# Altium project IOBoard2020.PrjPcb (part 3 of 3)

## Sheet PushButtons.SchDoc
size A3
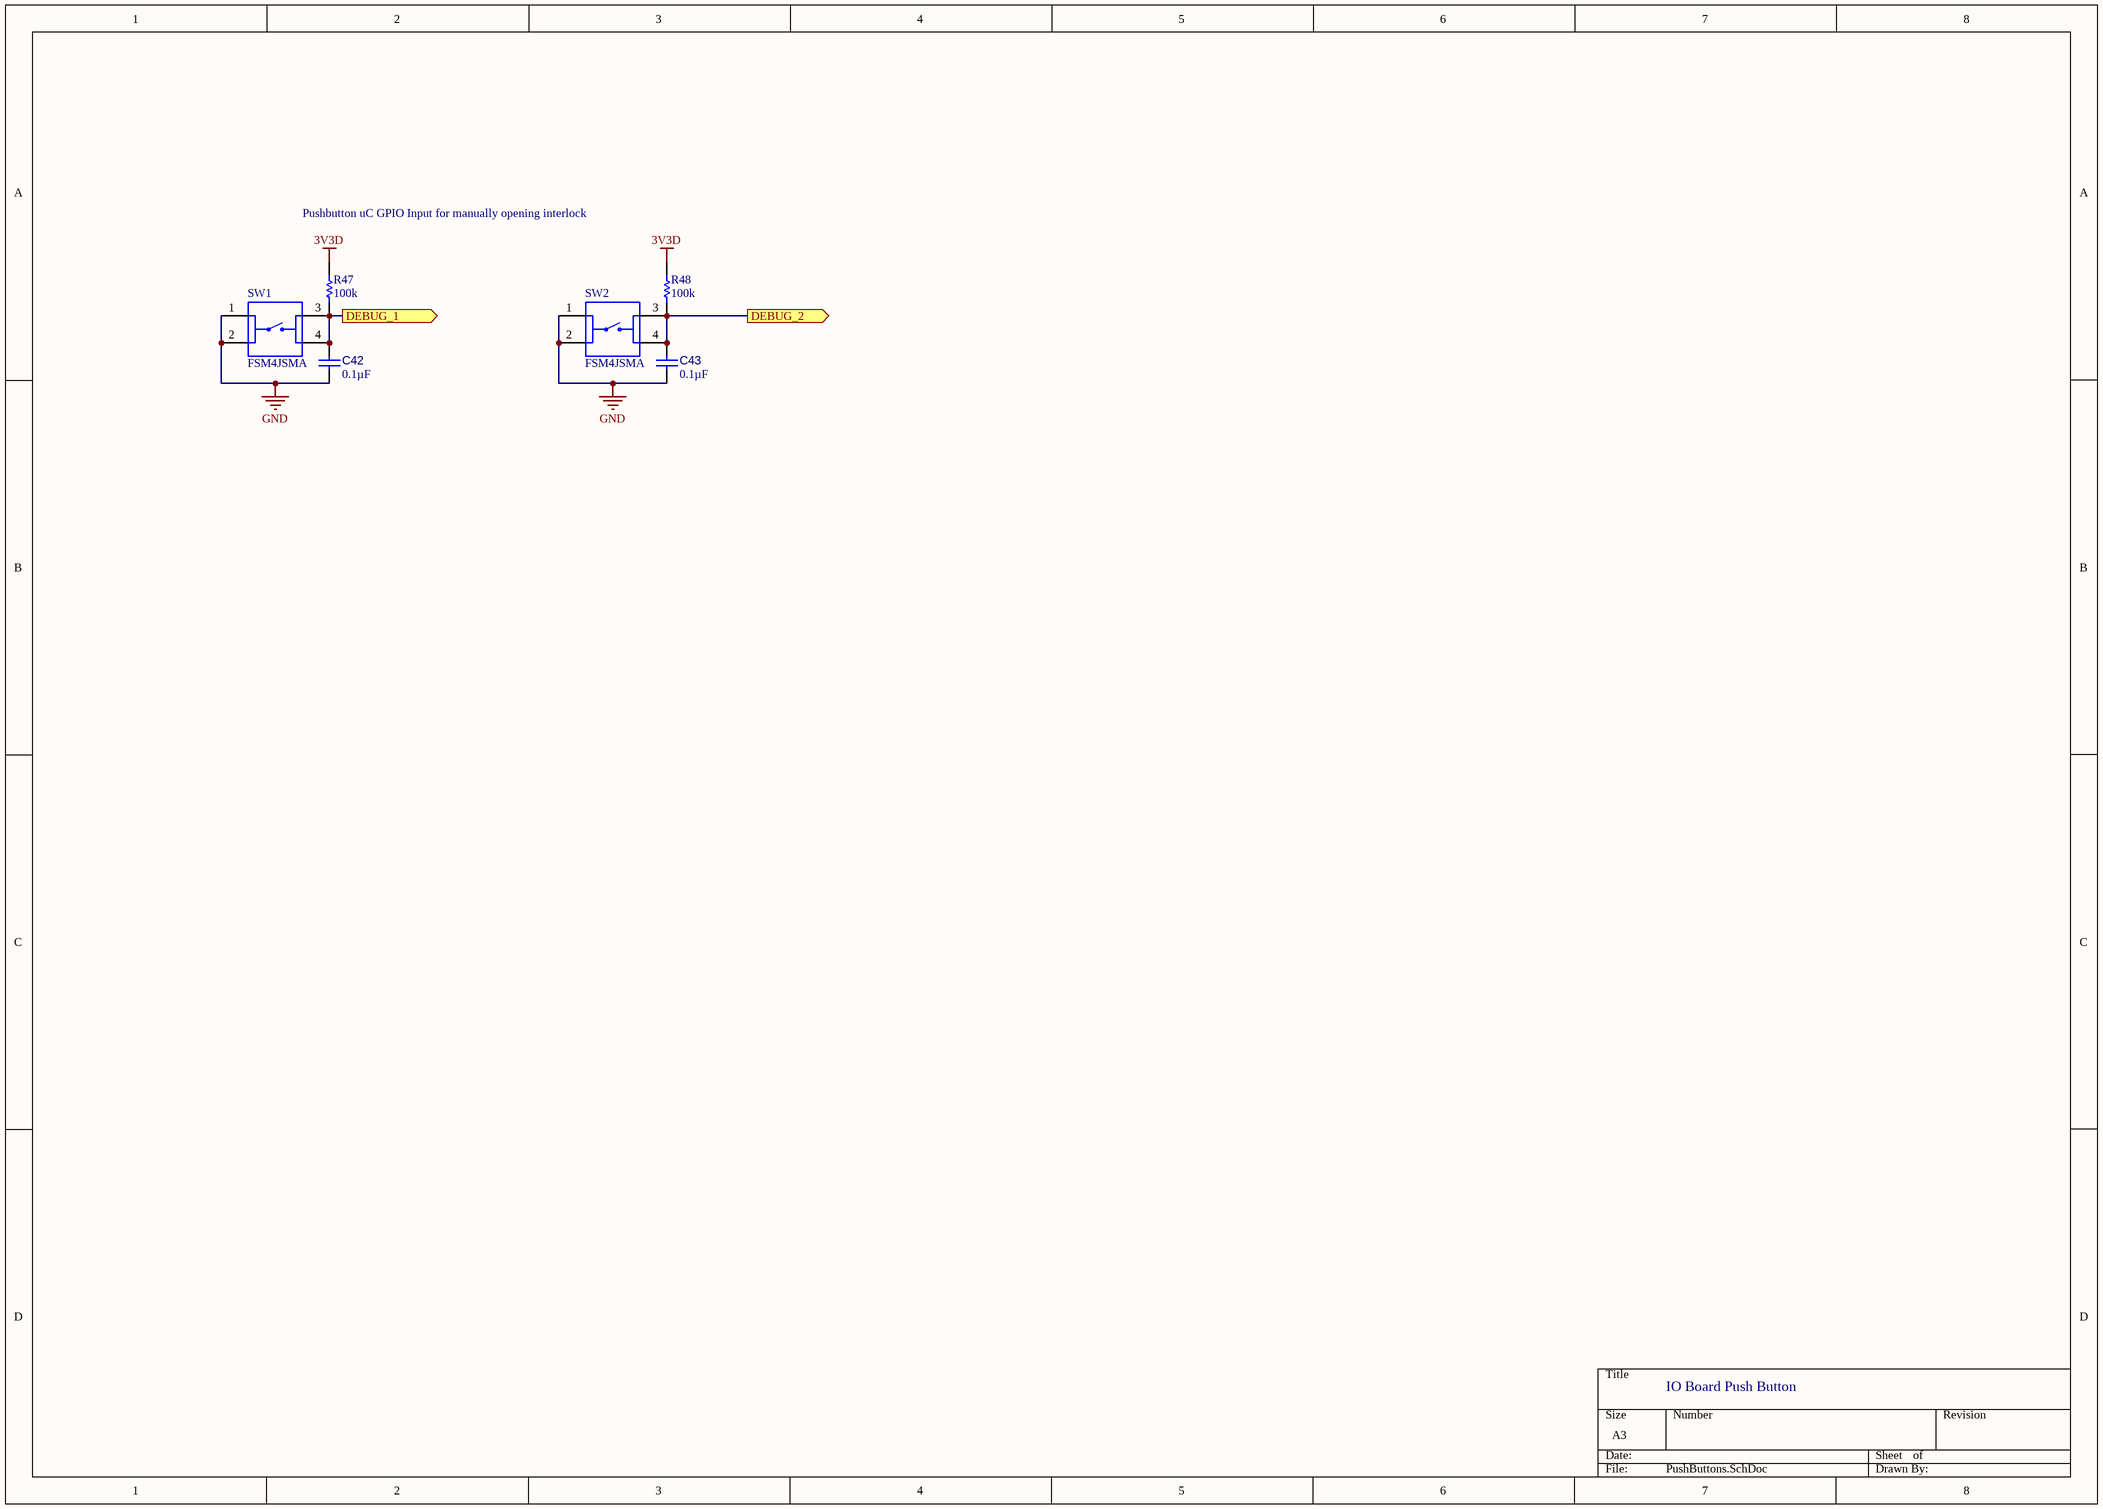
[diagram p6: PushButtons.SchDoc]

### Parts
C42  0.1µF  [CAPC2013X145X50ML20T25]
C43  0.1µF  [CAPC2013X145X50ML20T25]
R47  100k  [RESC2013X50X35ML15T15]
R48  100k  [RESC2013X50X35ML15T15]
SW1  FSM4JSMA  [TE_FSM4JSMA]
SW2  FSM4JSMA  [TE_FSM4JSMA]

### Ports
DEBUG_1 (out), DEBUG_2 (out)

### Nets
3V3D: R47.2 R48.2
GND: C42.1 C43.1 SW1.1 SW1.2 SW2.1 SW2.2
NetC42_2: C42.2 R47.1 SW1.3 SW1.4 ; port DEBUG_1
NetC43_2: C43.2 R48.1 SW2.3 SW2.4 ; port DEBUG_2

### Notes on the sheet
- Pushbutton uC GPIO Input for manually opening interlock
- IO Board Push Button

### Library data of the parts
C42 C43 = CMP-001-00010-4: Chip Capacitor, 0.1 uF, +/-10%, 25 V, 0805 (2012 Metric); Manufacturer: KEMET; Manufacturer Part Number: C0805C104K3RACTU; Dielectric Material: Ceramic; Tolerance: 10%; Capacitance: 100nF; Dielectric: X7R; Voltage: 25V; Value: 0.1µF; Supplier 1: Digi-Key; Supplier Part Number 1: 399-1168-1-ND; RoHS: Yes; Category: Ceramic Capacitors; Stock 1: 417116; Pricing 1: 1=0.14000, 10=0.10000, 50=0.05660, 100=0.04680, 500=0.03284, 1000=0.02719 (USD); Mount: Surface Mount; Case/Package: 0805; Min Operating Temperature: -55°C; Max Operating Temperature: 125°C; Packaging: Tape and Reel; Termination: SMD/SMT; Length: 2mm; Height: 0.9mm; Depth: 1.25mm; Radiation Hardening: No; ComponentLink1URL: https://datasheet.ciiva.com/18193/getdatasheetpartid-385649-18193413.pdf?src-supplier=Verical; ComponentLink1Description: https://datasheet.ciiva.com/18193/getdatasheetpartid-385649-18193413.pdf?src-supplier=Verical; ComponentLink2URL: https://datasheet.ciiva.com/7842/kem-c1002-x7r-smd-7842536.pdf?src-supplier=Element14; ComponentLink2Description: https://datasheet.ciiva.com/7842/kem-c1002-x7r-smd-7842536.pdf?src-supplier=Element14; ComponentLink3URL: https://datasheet.ciiva.com/7842/kem-c1002-x7r-smd-7842538.pdf?src-supplier=Element14; ComponentLink3Description: https://datasheet.ciiva.com/7842/kem-c1002-x7r-smd-7842538.pdf?src-supplier=Element14
R47 R48 = CMP-009-00001-4: Chip Resistor, 100k Ohm, +/- 1%, 125 mW, -55 to 155 degC, 0805 (2012 Metric); Manufacturer: Yageo; Manufacturer Part Number: RC0805FR-07100KL; Resistance: 100kR; Voltage Rating (DC): 150V; Temperature Coefficient: 100ppm/°C; Power Rating: 125mW; Value: 100k; Supplier 1: Digi-Key; Supplier Part Number 1: 311-100KCRCT-ND; RoHS: Yes; Category: Chip SMD Resistors; Stock 1: 3716407; Pricing 1: 1=0.10000, 10=0.03900, 100=0.01570, 1000=0.00705, 2500=0.00612 (USD); Case/Package: 0805; Number of Pins: 2; Case Code (Metric): 2012; Case Code (Imperial): 0805; Min Operating Temperature: -55°C; Max Operating Temperature: 155°C; Tolerance: 1%; Packaging: Tape and Reel; Composition: Thick Film; Voltage Rating: 150V; Package Quantity: 1; Number of Terminations: 2; Termination: SMD/SMT; Military Standard: Not; Max Power Dissipation: 125mW; Features: Moisture Resistant; Length: 2mm; Height: 0.024inch; Width: 0.049inch; Depth: 1.25mm; Lead Pitch: 0.4mm; REACH SVHC: Unknown; Lead Free: Lead Free; ComponentLink1URL: https://datasheet.ciiva.com/11808/0900766b8106beab-11808858.pdf?src-supplier=RSComponents; ComponentLink1Description: https://datasheet.ciiva.com/11808/0900766b8106beab-11808858.pdf?src-supplier=RSComponents; ComponentLink2URL: https://datasheet.ciiva.com/2457/pyu-r-int-thick-7-2457017.pdf?src-supplier=Digi-Key; ComponentLink2Description: https://datasheet.ciiva.com/2457/pyu-r-int-thick-7-2457017.pdf?src-supplier=Digi-Key; ComponentLink3URL: https://datasheet.ciiva.com/12667/rc0805-12667001.pdf?src-supplier=Mouser; ComponentLink3Description: https://datasheet.ciiva.com/12667/rc0805-12667001.pdf?src-supplier=Mouser; ComponentLink4URL: https://datasheet.ciiva.com/2457/pyu-r-int-thick-7-2457018.pdf?src-supplier=Digi-Key; ComponentLink4Description: https://datasheet.ciiva.com/2457/pyu-r-int-thick-7-2457018.pdf?src-supplier=Digi-Key; ComponentLink5URL: https://datasheet.ciiva.com/16747/rc0805-16747226.pdf?src-supplier=Future+Electronics; ComponentLink5Description: https://datasheet.ciiva.com/16747/rc0805-16747226.pdf?src-supplier=Future+Electronics; ComponentLink6URL: https://datasheet.ciiva.com/2457/pyu-r-int-thick-7-2457019.pdf?src-supplier=Digi-Key; ComponentLink6Description: https://datasheet.ciiva.com/2457/pyu-r-int-thick-7-2457019.pdf?src-supplier=Digi-Key; ComponentLink7URL: https://datasheet.ciiva.com/7660/38627-7660796.pdf?src-supplier=Element14; ComponentLink7Description: https://datasheet.ciiva.com/7660/38627-7660796.pdf?src-supplier=Element14; ComponentLink8URL: https://datasheet.ciiva.com/7941/1697719-7941676.pdf?src-supplier=Element14; ComponentLink8Description: https://datasheet.ciiva.com/7941/1697719-7941676.pdf?src-supplier=Element14; ComponentLink9URL: https://datasheet.ciiva.com/7941/1686128-7941677.pdf?src-supplier=Element14; ComponentLink9Description: https://datasheet.ciiva.com/7941/1686128-7941677.pdf?src-supplier=Element14; ComponentLink10URL: https://datasheet.ciiva.com/7941/1697719-7941678.pdf?src-supplier=Element14; ComponentLink10Description: https://datasheet.ciiva.com/7941/1697719-7941678.pdf?src-supplier=Element14; ComponentLink11URL: https://datasheet.ciiva.com/22747/444164-22747534.pdf?src-supplier=Element14; ComponentLink11Description: https://datasheet.ciiva.com/22747/444164-22747534.pdf?src-supplier=Element14
SW1 SW2 = FSM4JSMA: Tactile Switch SPST-NO Top Actuated Surface Mount; Contact_Current_Rating: 50 mA; Configuration_Pole-Throw: Single Pole - Single Throw; MF: TE Connectivity; SnapEDA_Link: https://www.snapeda.com/parts/FSM4JSMA/TE%20Connectivity%20ALCOSWITCH%20Switches/view-part/543632/?ref=snap; Availability: Unavailable; TE_purchase_URL: https://www.te.com/usa-en/product-4-1437565-1.html?te_bu=Cor&te_type=disp&te_campaign=seda_glo_cor-seda-global-disp-prtnr-fy19-seda-model-bom-cta_sma-317_1&elqCampaignId=32493; MP: FSM4JSMA; EU_RoHS_Compliance: Compliant; Price: None; Value: *; Package: None

## Nets that join several sheets
3V3A: uController (6 pins), Power (C41.1 L1.2)
3V3D: uController (31 pins), Connectors (F1.1 F5.1 F6.1 R31.1), Interlock (C24.2 IC4.8 R24.1 R29.2), Sensors (R38.1), Power (5 pins), PushButtons (R47.2 R48.2)
5V: uController (C12.1 U1.3), Connectors (6 pins), Interlock (IC2.6 IC3.6), Sensors (22 pins), Power (C39.2 F7.2 R45.2 U15.3)
GND: uController (42 pins), Connectors (18 pins), Interlock (10 pins), Sensors (27 pins), Power (8 pins), PushButtons (6 pins)
PGND: Connectors (J6.1), Interlock (IC2.3 IC3.3), Power (C37.2 LED2.1 P1.2 P1.3)
VIN: Connectors (F2.1), Power (C37.1 P1.1 R44.1)
ACCEL_1: Connectors (J10.1 J11.3), Sensors (U9.2)
ACCEL_2: Connectors (J10.4 J11.6), Sensors (U9.3)
BRAKE_1: Connectors (J9.3 J11.1), Sensors (R40.1 U11.2 U12.1)
BRAKE_2: Connectors (J9.6 J11.4), Sensors (R43.1 U11.3 U14.1)
CAN1_N: uController (R3.1 U1.6), Connectors (J2.2 J3.2)
CAN1_P: uController (R3.2 U1.7), Connectors (J2.1 J3.1)
NetC42_2: uController (IC1.99), PushButtons (C42.2 R47.1 SW1.3 SW1.4)
NetC43_2: uController (IC1.41), PushButtons (C43.2 R48.1 SW2.3 SW2.4)
NetIC1_26: uController (IC1.26), Sensors (SJ3.3 U4.2)
NetIC1_27: uController (IC1.27), Sensors (R34.2 R35.2)
NetIC1_28: uController (IC1.28), Sensors (SJ6.3 U7.2)
NetIC1_29: uController (IC1.29), Sensors (SJ4.3 U5.2)
NetIC1_47: uController (IC1.47), Sensors (SJ5.3 U6.2)
NetIC1_48: uController (IC1.48), Sensors (R36.2 R37.2)
NetIC1_49: uController (IC1.49), Sensors (SJ8.3 U10.2)
NetIC1_50: uController (IC1.50), Sensors (SJ7.3 U8.2)
NetIC1_72: uController (IC1.72), Connectors (J7.1), Sensors (LED1.1 R41.2 U13.4)
NetIC1_73: uController (IC1.73), Connectors (R33.1)
NetIC1_74: uController (IC1.74), Connectors (R32.1)
NetIC1_75: uController (IC1.75), Connectors (J1.3)
NetIC1_79: uController (IC1.79), Connectors (J1.4)
NetIC1_92: uController (IC1.92), Interlock (Q1.1 R27.2)
NetIC1_93: uController (IC1.93), Interlock (IC2.5)
NetIC1_94: uController (IC1.94), Interlock (IC3.5)
NetIC1_95: uController (IC1.95), Interlock (R25.2 R26.2)
NetIC1_96: uController (IC1.96), Interlock (R29.1 R30.2)
NetJ5_1: Connectors (J5.1), Interlock (K1.5 R28.1)
NetJ5_2: Connectors (J5.2), Interlock (K1.4 K1.6 R23.1)